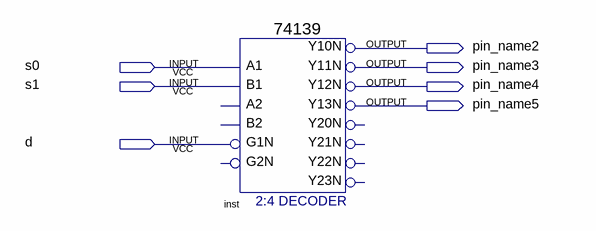
[diagram p0: schematic sheet]
// Quartus schematic xuan41.bdf as structural Verilog: 1 symbols, 7 pins
module xuan41 (
  input  s0,
  input  s1,
  input  d,
  output pin_name2,
  output pin_name3,
  output pin_name4,
  output pin_name5
);

  \74139  inst (
    .A1(s0), .B1(s1), .G1N(d), .Y10N(pin_name2), .Y13N(pin_name5), .Y12N(pin_name4), .Y11N(pin_name3));  // open: A2, B2, G2N, Y20N, Y21N, Y22N, Y23N
endmodule
